# EAGLE schematic schematic (EAGLE 9.7.0)
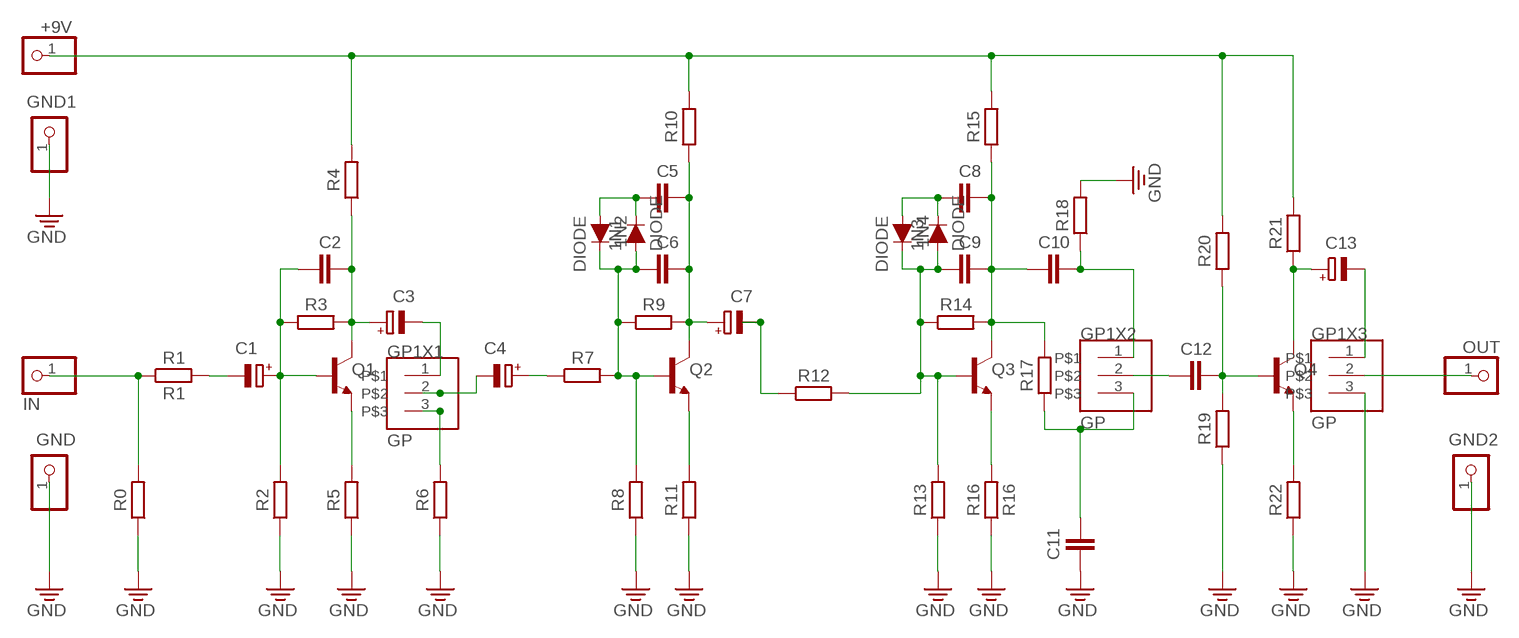
[diagram p0: schematic, sheet 1]

## Parts
1N1  DIODE  [DIODE-1N4148]
1N2  DIODE  [DIODE-1N4148]
1N3  DIODE  [DIODE-1N4148]
1N4  DIODE  [DIODE-1N4148]
+9V  PINHD-1X1  [1X01]
C1  C  [CAP]
C2  CUN  [CAPPRR250W50L310T100H650B]
C3  C  [CAP]
C4  C  [CAP]
C5  CUN  [CAPPRR250W50L310T100H650B]
C6  CUN  [CAPPRR250W50L310T100H650B]
C7  C  [CAP]
C8  CUN  [CAPPRR250W50L310T100H650B]
C9  CUN  [CAPPRR250W50L310T100H650B]
C10  CUN  [CAPPRR250W50L310T100H650B]
C11  CUN  [CAPPRR250W50L310T100H650B]
C12  CUN  [CAPPRR250W50L310T100H650B]
C13  C  [CAP]
GND  PINHD-1X1  [1X01]
GND1  PINHD-1X1  [1X01]
GND2  PINHD-1X1  [1X01]
GP1X1  GP  [HDRV3W64P254_1X3_762X254X838B]
GP1X2  GP  [HDRV3W64P254_1X3_762X254X838B]
GP1X3  GP  [HDRV3W64P254_1X3_762X254X838B]
IN  PINHD-1X1  [1X01]
OUT  PINHD-1X1  [1X01]
Q1  BC550B  [TO92-EBC]
Q2  BC550B  [TO92-EBC]
Q3  BC550B  [TO92-EBC]
Q4  BC550B  [TO92-EBC]
R0  R_AXIAL-7.2MM-PITCH  [RESAD724W46L381D178B]
R1  R1  R_AXIAL-7.2MM-PITCH  [RESAD724W46L381D178B]
R2  R_AXIAL-7.2MM-PITCH  [RESAD724W46L381D178B]
R3  R_AXIAL-7.2MM-PITCH  [RESAD724W46L381D178B]
R4  R_AXIAL-7.2MM-PITCH  [RESAD724W46L381D178B]
R5  R_AXIAL-7.2MM-PITCH  [RESAD724W46L381D178B]
R6  R_AXIAL-7.2MM-PITCH  [RESAD724W46L381D178B]
R7  R_AXIAL-7.2MM-PITCH  [RESAD724W46L381D178B]
R8  R_AXIAL-7.2MM-PITCH  [RESAD724W46L381D178B]
R9  R_AXIAL-7.2MM-PITCH  [RESAD724W46L381D178B]
R10  R_AXIAL-7.2MM-PITCH  [RESAD724W46L381D178B]
R11  R_AXIAL-7.2MM-PITCH  [RESAD724W46L381D178B]
R12  R_AXIAL-7.2MM-PITCH  [RESAD724W46L381D178B]
R13  R_AXIAL-7.2MM-PITCH  [RESAD724W46L381D178B]
R14  R_AXIAL-7.2MM-PITCH  [RESAD724W46L381D178B]
R15  R_AXIAL-7.2MM-PITCH  [RESAD724W46L381D178B]
R16  R16  R_AXIAL-7.2MM-PITCH  [RESAD724W46L381D178B]
R17  R_AXIAL-7.2MM-PITCH  [RESAD724W46L381D178B]
R18  R_AXIAL-7.2MM-PITCH  [RESAD724W46L381D178B]
R19  R_AXIAL-7.2MM-PITCH  [RESAD724W46L381D178B]
R20  R_AXIAL-7.2MM-PITCH  [RESAD724W46L381D178B]
R21  R_AXIAL-7.2MM-PITCH  [RESAD724W46L381D178B]
R22  R_AXIAL-7.2MM-PITCH  [RESAD724W46L381D178B]

## Nets
GND: C11.1 GND1.1 GND2.1 GND.1 GP1X3.3 R0.1 R2.1 R5.1 R6.1 R8.1 R11.1 R13.1 R16.1 R18.2 R19.1 R22.1
N$1: IN.1 R0.2 R1.1
N$2: C1.2(-) R1.2
N$3: C1.1(+) C2.1 Q1.B R2.2 R3.1
N$4: Q1.E R5.2
N$5: C2.2 C3.1(+) Q1.C R3.2 R4.1
N$7: C3.2(-) GP1X1.1
N$8: C4.2(-) GP1X1.2
N$9: GP1X1.3 R6.2
N$10: C4.1(+) R7.1
N$11: 1N1.A 1N2.C C6.1 Q2.B R7.2 R8.2 R9.1
N$12: C5.2 C6.2 C7.1(+) Q2.C R9.2 R10.1
N$13: 1N1.C 1N2.A C5.1
N$14: Q2.E R11.2
N$15: C7.2(-) R12.1
N$16: 1N3.A 1N4.C C9.1 Q3.B R12.2 R13.2 R14.1
N$17: C8.2 C9.2 C10.1 Q3.C R14.2 R15.1 R17.2
N$18: 1N3.C 1N4.A C8.1
N$19: Q3.E R16.2
N$20: C10.2 GP1X2.1 R18.1
N$21: C11.2 GP1X2.3 R17.1
N$22: C12.1 GP1X2.2
N$23: C12.2 Q4.B R19.2 R20.1
N$24: C13.1(+) Q4.C R21.1
N$25: Q4.E R22.2
N$26: C13.2(-) GP1X3.1
N$27: GP1X3.2 OUT.1
N$28: +9V.1 R4.2 R10.2 R15.2 R20.2 R21.2

## Library data of the parts
1N1-1N4 = Biblioteka:DIODE: Diode These are standard reverse protection diodes and small signal diodes. SparkFun Products: SparkFun SparkPunk Sound Kit <https://www.sparkfun.com/products/11177> SparkFun ESP8266 Thing <https://www.sparkfun.com/products/13231>
+9V GND GND1 GND2 IN OUT = Connector:PINHD-1X1: PIN HEADER; CATEGORY: CONNECTOR; SUB-CATEGORY: PIN-HEADER
C1 C3 C4 C7 C13 = lib:C
C2 C5 C6 C8-C12 = lib:CUN
GP1X1-GP1X3 = lib:GP
Q1-Q4 = transistor-npn:BC550*: NPN Transistor
R0 R1-R22 = Resistor:R: Resistor Fixed - Generic; CATEGORY: Resistor; SUB-CATEGORY: Fixed